# Altium schematic sheet Sheet1.SchDoc
size A
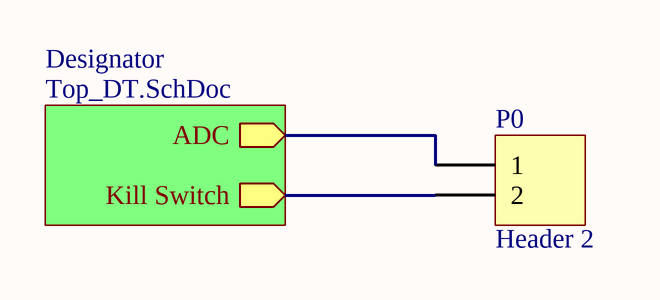
[diagram p0: Sheet1.SchDoc]

## Parts
P0  Header 2  [HDR1X2]

## Sub-sheets
Designator = Top_DT.SchDoc: ADC (out), Kill Switch (out)

## Nets
NetP0_1: P0.1 ; sheet Designator/ADC
NetP0_2: P0.2 ; sheet Designator/Kill Switch

## Library data of the parts
P0 = Header 2: Header, 2-Pin; LatestRevisionDate: 17-Jul-2002; LatestRevisionNote: Re-released for DXP Platform.; Publisher: Altium Limited